# EAGLE schematic esp8266Duino (EAGLE 7.3.0)
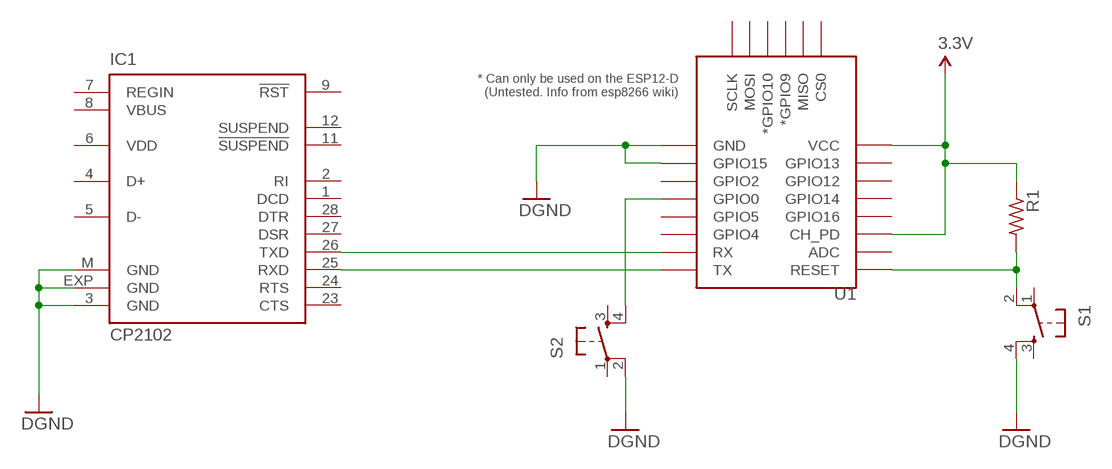
[diagram p0: schematic, sheet 1]

## Parts
IC1  CP2102  [MLP28]
R1  R-US_0204/2V  [0204V]
S1  TAC_SWITCHPTH  [TACTILE-PTH]
S2  TAC_SWITCHPTH  [TACTILE-PTH]
U1  ESP12ESMD  [ESP12E-SMD]

## Nets
3.3V: R1.1 U1.CH_PD U1.VCC
GND: IC1.3(GND) IC1.EXP(GND) IC1.M(GND) S1.4 S2.2 U1.GND U1.GPIO15 ; supply symbol labelled DGND
N$1: IC1.26(TXD) U1.RXD0(RX)
N$2: IC1.25(RXD) U1.TXD0(TX)
N$3: R1.2 S1.2 U1.RESET
N$4: S2.4 U1.GPIO0
Unconnected: IC1.1(DCD) IC1.2(RI) IC1.4(D+) IC1.5(D-) IC1.7(REGIN) IC1.8(VBUS) IC1.9(!RST) IC1.11(!SUSPEND) IC1.12(SUSPEND) IC1.23(CTS) IC1.24(RTS) IC1.27(DSR) IC1.28(DTR) S1.1 S1.3 S2.1 S2.3 U1.ADC U1.CS0 U1.GPIO2 U1.GPIO4 U1.GPIO5 U1.GPIO9(*GPIO9) U1.GPIO10(*GPIO10) U1.GPIO12 U1.GPIO13 U1.GPIO14 U1.GPIO16 U1.MISO U1.MOSI U1.SCLK

## Power pins joined to a net without a drawn wire
VDD: IC1.6(VDD)

## Library data of the parts
IC1 = silabs:CP210*: Single-Chip USB to UART Bridge Source: www.silabs.com .. CP2101.pdf / cp2102.pdf; MF: FARNELL; MPN: CP2102-GM; OC_FARNELL: 9282130; OC_NEWARK: 30K5635
R1 = adafruit:R-US_: RESISTOR, American symbol
S1 S2 = SparkFun-Retired:TAC_SWITCH: Momentary Switch Button commonly used for reset or general input. Spark Fun Electronics SKU : COM-00097 SMT- SWCH-08247
U1 = esp8266modules:ESP12E: ESP12E Module